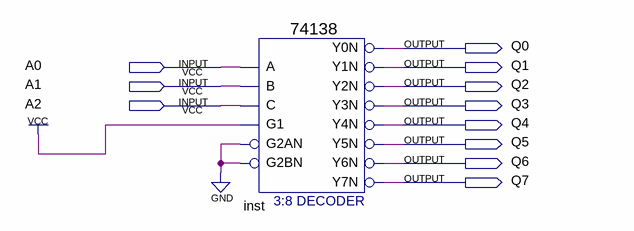
[diagram p0: schematic sheet]
// Quartus schematic EL74138.bdf as structural Verilog: 1 symbols, 11 pins
module EL74138 (
  input  A0,
  input  A1,
  input  A2,
  output Q0,
  output Q1,
  output Q2,
  output Q3,
  output Q4,
  output Q5,
  output Q6,
  output Q7
);

  \74138  inst (
    .A(A0), .B(A1), .G1(1'b1), .C(A2), .G2AN(1'b0), .G2BN(1'b0), .Y0N(Q0), .Y1N(Q1), .Y2N(Q2), .Y3N(Q3),
    .Y4N(Q4), .Y5N(Q5), .Y6N(Q6), .Y7N(Q7));
endmodule
